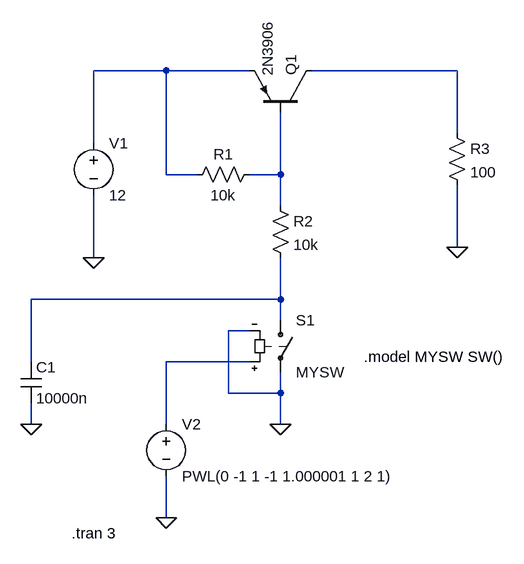
[diagram p0: schematic pnp_switch.asc]
pnp_switch.asc, the LTspice schematic file:
Version 4
SHEET 1 880 728
WIRE 240 0 128 0
WIRE 368 0 240 0
WIRE 688 0 464 0
WIRE 688 96 688 0
WIRE 128 112 128 0
WIRE 240 160 240 0
WIRE 288 160 240 160
WIRE 416 160 416 64
WIRE 416 160 368 160
WIRE 416 208 416 160
WIRE 688 272 688 176
WIRE 128 288 128 192
WIRE 416 352 416 288
WIRE 416 352 32 352
WIRE 416 384 416 352
WIRE 368 400 336 400
WIRE 32 448 32 352
WIRE 368 448 240 448
WIRE 336 496 336 400
WIRE 416 496 416 464
WIRE 416 496 336 496
WIRE 32 544 32 512
WIRE 240 544 240 448
WIRE 416 544 416 496
WIRE 240 688 240 624
FLAG 128 288 0
FLAG 688 272 0
FLAG 416 544 0
FLAG 240 688 0
FLAG 32 544 0
SYMBOL voltage 128 96 R0
WINDOW 123 0 0 Left 0
WINDOW 39 0 0 Left 0
SYMATTR InstName V1
SYMATTR Value 12
SYMBOL pnp 464 64 M270
SYMATTR InstName Q1
SYMATTR Value 2N3906
SYMBOL res 272 176 R270
WINDOW 0 32 56 VTop 2
WINDOW 3 0 56 VBottom 2
SYMATTR InstName R1
SYMATTR Value 10k
SYMBOL res 400 192 R0
SYMATTR InstName R2
SYMATTR Value 10k
SYMBOL res 672 80 R0
SYMATTR InstName R3
SYMATTR Value 100
SYMBOL sw 416 368 R0
SYMATTR InstName S1
SYMATTR Value MYSW
SYMBOL voltage 240 528 R0
WINDOW 123 0 0 Left 0
WINDOW 39 0 0 Left 0
SYMATTR InstName V2
SYMATTR Value PWL(0 -1 1 -1 1.000001 1 2 1)
SYMBOL cap 16 448 R0
SYMATTR InstName C1
SYMATTR Value 10000n
TEXT 94 712 Left 2 !.tran 3
TEXT 544 440 Left 2 !.model MYSW SW()

The netlist it stands for:
* pnp_switch.asc
V1 N001 0 12
Q1 N002 N003 N001 0 2N3906
R1 N001 N003 10k
R2 N003 N004 10k
R3 N002 0 100
S1 N004 0 N005 0 MYSW
V2 N005 0 PWL(0 -1 1 -1 1.000001 1 2 1)
C1 N004 0 10000n
.model NPN NPN
.model PNP PNP
.lib standard.bjt
.tran 3
.model MYSW SW()
.backanno
.end